# Altium project Brightness_measure.PrjPcb
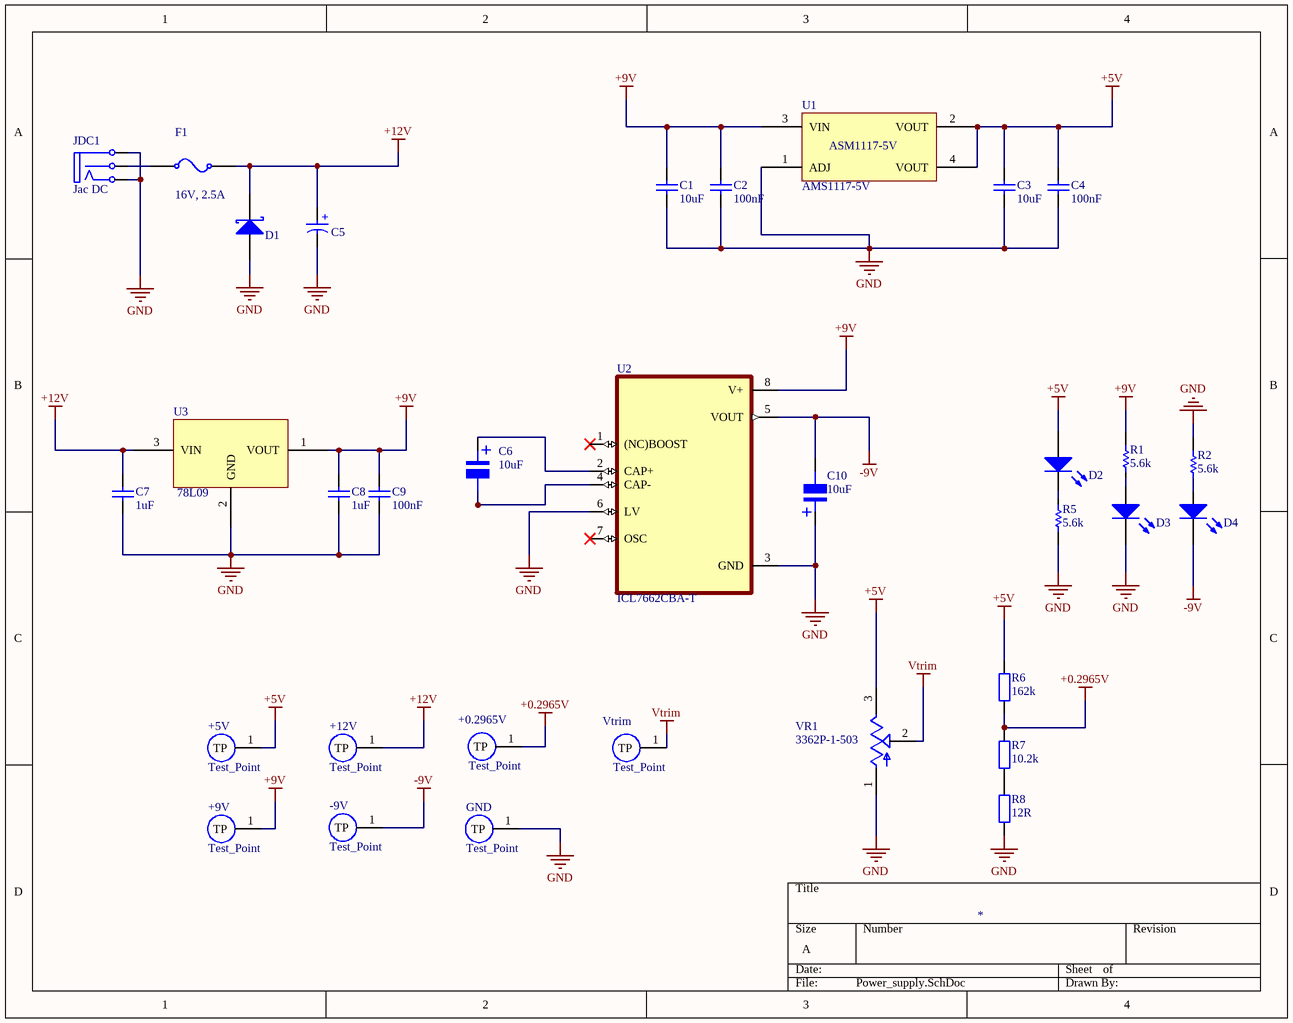
[diagram p0: Power_supply.SchDoc]
2 sheets, 56 parts. Net scope: flat (ports and power ports of the same name join across sheets).
Board file: PCB3.PcbDoc
Sheets:
  Power_supply.SchDoc
  Measure.SchDoc

## Sheet Power_supply.SchDoc
size A; SheetNumber: 1; SheetTotal: 2

### Parts
+0.2965V  Test_Point  [TP_2MM]
+5V  Test_Point  [TP_2MM]
+9V  Test_Point  [TP_2MM]
+12V  Test_Point  [TP_2MM]
-9V  Test_Point  [TP_2MM]
C1  10uF  [CAP_0603]
C2  100nF  [CAP_0603]
C3  10uF  [CAP_0603]
C4  100nF  [CAP_0603]
C5  22uF  [WCAP-ASLI_D4H5.5]  (value not drawn)
C6  10uF  [tu nhom 4 (b)]
C7  1uF  [CAP_0603]
C8  1uF  [CAP_0603]
C9  100nF  [CAP_0603]
C10  10uF  [tu nhom 4 (b)]
D1  D Schottky  [SS34]  (value not drawn)
D2  LED SMD  [LED_0805_Blue]  (value not drawn)
D3  LED SMD  [LED_0805_Blue]  (value not drawn)
D4  LED SMD  [LED_0805_Blue]  (value not drawn)
F1  16V, 2.5A  [Fuse_SMD_1812]
GND  Test_Point  [TP_2MM]
JDC1  Jac DC  [DC0]
R1  5.6k  [resistor_0603]
R2  5.6k  [resistor_0603]
R5  5.6k  [resistor_0603]
R6  162k  [TRO SMD 0603]
R7  10.2k  [TRO SMD 0603]
R8  12R  [TRO SMD 0603]
U1  AMS1117-5V  [AMS1117-3.3V SOT223]
U2  ICL7662CBA-T  [SOP 8]
U3  78L09  [SOT89]
VR1  3362P-1-503  [TRIM_3362P-1-503]
Vtrim  Test_Point  [TP_2MM]

### Nets
+0.2965V: +0.2965V.1(TP) R6.1 R7.2
+5V: +5V.1(TP) C3.2 C4.2 D2.1(A) R6.2 U1.2(VOUT) U1.4(VOUT) VR1.3(CW)
+9V: +9V.1(TP) C1.1 C2.2 C8.2 C9.2 R1.2 U1.3(VIN) U2.8(V+) U3.1(VOUT)
+12V: +12V.1(TP) C5.1(P) C7.2 D1.2(K) F1.1 U3.3(VIN)
-9V: -9V.1(TP) C10.2 D4.2(K) U2.5(VOUT)
GND: C1.2 C2.1 C3.1 C4.1 C5.2(N) C7.1 C8.1 C9.1 C10.1 D1.1(A) D3.2(K) GND.1(TP) JDC1.2(TN) JDC1.3(T) R2.2 R5.1 R8.1 U1.1(ADJ) U2.3(GND) U2.6(LV) U3.2(GND) VR1.1(CCW)
Vtrim: VR1.2(WIPER) Vtrim.1(TP)
NetC6_1: C6.1 U2.2(CAP+)
NetC6_2: C6.2 U2.4(CAP-)
NetD2_2: D2.2(K) R5.2
NetD3_1: D3.1(A) R1.1
NetD4_1: D4.1(A) R2.1
NetF1_0: F1.0 JDC1.1(S)
NetR7_1: R7.1 R8.2

Not connected (* = marked no-connect by the designer): U2 1((NC)BOOST)* 7(OSC)*

### Notes on the sheet
- (in symbol 865080340003) +
- (in symbol AMS1117-5V) ASM1117-5V
- (in symbol Tu Nhom 10uF 16V) +

### Library data of the parts
+0.2965V +5V +9V +12V -9V GND Vtrim = Test_Point: Test point, 2mm radius
C1 C3 = 01060310010: CAP, size 0603,10uF; Supply 2 name: Thegioiic; Capacitance Tolerance: +/-10%; ComponentLink1Description: Manufacturer; ComponentLink1URL: *; ComponentLink2Description: Datasheet; ComponentLink2URL: *; Operating Temperature: -55 to +125degC; Packaging: Tape and Reel; Supply 1 SN: *; Supply 1 name: *; Supply 1 URL: *; Supply 2 SN: *; Supply 2 URL: https://www.thegioiic.com/tu-gom-0603-10uf-16v; Dissipation Factor: *; Height: *; Mounting Technology: SMT; Size: 0603; Capacitance: 10uF; Technical Reference: *
C2 C4 C9 = 01060310410: CAP, size 0603, 100nF; Supply 1 SN: 885012206095; Supply 1 name: Wurth Elektronik; Supply 2 name: Thegioiic; Capacitance Tolerance: +/-10%; ComponentLink1Description: Manufacturer; ComponentLink1URL: http://www.we-online.de; ComponentLink2Description: Datasheet; ComponentLink2URL: https://www.we-online.com/catalog/datasheet/885012206095.pdf; Operating Temperature: -55 to +125degC; Packaging: Tape and Reel; Supply 1 URL: https://www.we-online.com/en/components/products/WCAP-CSGP-50VDC?sq=885012206095R#885012206095R; Supply 2 SN: *; Supply 2 URL: https://www.thegioiic.com/tu-gom-0603-100nf-0-1uf-50v; Dissipation Factor: *; Height: *; Mounting Technology: SMT; Size: 0603; Capacitance: 100nF; Technical Reference: *
C5 = 865080340003: V-Chip, D4 x H5.5mm, 22uF, 16V; Capacitance Tolerance: +/-20%; Dissipation Factor: 16%; Endurance: 2000h; Leakage Current: 3.52uA; Ripple Current: 90mA; Supply 1 Name: Mouser; Supply 1 SN: 710-865080340003; Supply 2 Name: thegioiic; Category: Aluminum Electrolytic Capacitors; ComponentLink2Description: Datasheet Link; ComponentLink2URL: https://www.we-online.com/redexpert/spec/865080340003?ad; Mount: Surface Mount; Operating Temperature Max: 105°C; Operating Temperature Min: -55°C; Packaging: Tape and Reel; Height: 5.5mm; Diameter: 4mm; Capacitance: 22uF; Rated Voltage (DC): 16V; Supply 1 URL: https://www.mouser.com/ProductDetail/Wurth-Elektronik/865080340003?qs=0KOYDY2FL2%252BowmC4S50IuQ%3D%3D; Supply 2 URL: https://www.thegioiic.com/tu-nhom-smd-22uf-16v-4x5-4mm
C6 C10 = Tu Nhom 10uF 16V: Dán; Don_Vi: Con; So_Chan: 2; Ten_Linh_Kien: Tụ Nhôm 10uF 16V 4x5MM; Ma_Hang: MH001458; Chung_Loai: Dán; Kieu_Chan: *
C7 C8 = 01060310510: CAP, size 0603, 1uF; Supply 1 SN: 885012206126; Supply 1 name: Wurth Elektronik; Supply 2 name: Thegioiic; Capacitance Tolerance: +/-10%; ComponentLink1Description: Manufacturer; ComponentLink1URL: http://www.we-online.de; ComponentLink2Description: Datasheet; ComponentLink2URL: https://www.we-online.com/components/products/datasheet/885012206126.pdf; Operating Temperature: -55 to +125degC; Packaging: Tape and Reel; Supply 1 URL: https://www.we-online.com/en/components/products/WCAP-CSGP-50VDC?sq=885012206126#885012206126; Supply 2 SN: *; Supply 2 URL: https://www.thegioiic.com/tu-gom-0603-1uf-50v; Dissipation Factor: *; Height: *; Mounting Technology: SMT; Size: 0603; Capacitance: 1uF; Technical Reference: *
D1 = D Schottky: Schottky Diode; Published: 8-Jun-2000; LatestRevisionDate: 17-Jul-2002; LatestRevisionNote: Re-released for DXP Platform.; PackageReference: SMB; Publisher: Altium Limited; PackageDescription: DO-214-AA/SMB; 2 C-Bend Leads; Body 5.3 x 3.6 mm, inc. leads (LxW); Code_JEDEC: DO-214-AA
D2-D4 = LED SMD: LED
F1 = 061812200008: Resettable Fuse, Size 1812, 8V, 2A; Manufacturer: Littelfuse; Threshold Current: 100A; Trip Current: 4A; Supply 1 Name: Mouser; Supply 1 SN: 650-MINISMDC200F-2; Supply 2 Name: Digikey; Supply 2 SN: MINISMDC200F-2TR-ND; Supply 3 Name: Thegioiic; Threshold Voltage: 8V; Hold Current: 2A; Size: 1812; Mounting Technology: SMT/SMD; ComponentLink1Description: Datasheet link; ComponentLink1URL: https://www.littelfuse.com/~/media/electronics/product_specifications/resettable_ptcs/littelfuse_ptc_minismdc300f_2_product_specification.pdf.pdf; ComponentLink2Description: Supply 1 URL; ComponentLink2URL: https://www.mouser.vn/ProductDetail/Littelfuse/MINISMDC200F-2?qs=F6FIpiMdEVbPu4q%2F42CC1w%3D%3D; ComponentLink3Description: Supply 2 URL; ComponentLink3URL: https://www.digikey.com/en/products/detail/littelfuse-inc/MINISMDC200F-2/1045898?s=N4IgTCBcDaIAQFkCSA5JBlBARAwmADPgGIC0EAugL5A; ComponentLink4Description: Supply 3 URL; ComponentLink4URL: https://www.thegioiic.com/cau-chi-tu-phuc-hoi-1812-8v-2a; Supply 3 SN: N/A
JDC1 = DCIN: Jac DC input; Value: Jac DC
R1 R2 R5 = 0006035621: RES, 5.6k Ohm, size 0603, 1%; Resistance Tolerant: +/-1%; Rated Power: 1/4W; Supply 1 Name: Mouser; Supply 1 SN: 667-ERJ-UP3F5601V; Supply 2 Name: Digikey; Supply 2 SN: 10-ERJ-UP3F5601VTR-ND 10-ERJ-UP3F5601VCT-ND 10-ERJ-UP3F5601VDKR-ND; Resistance: 5.6k; Size: 0603; Mounting Technology: SMT; ComponentLink1Description: Datasheet link; ComponentLink1URL: https://api.pim.na.industrial.panasonic.com/file_stream/main/fileversion/4484; ComponentLink2Description: Supply 1 URL; ComponentLink2URL: https://www.mouser.vn/ProductDetail/Panasonic/ERJ-UP3F5601V?qs=sGAEpiMZZMvdGkrng054twq3eZrCFN89ezYxgAsnxBTZYD17cS%252B65A%3D%3D; ComponentLink3Description: Supply 2 URL; ComponentLink3URL: https://www.digikey.com/en/products/detail/panasonic-electronic-components/ERJ-UP3F5601V/12092890
R6 = Tro 0603 1% 162k: Dán
R7 = tro 0603 1% 10.2k: Dán
R8 = tro 0805 1% 12R: Dán
U1 = AMS1117-5V: AMS1117-5V, OUT 5V 1A.
U2 = ICL7662CBA-T: MF: {'manufacturer': u'Analog Devices Inc./Maxim Integrated'}; MP: ICL7662CBA+T; Package: None; Price: None; Value: *; Availability: Unavailable
U3 = 78L09: 78L09, OUT 9V, 0.1A
VR1 = 3362P-1-503: 50 kOhms 0.5W, 1/2W PC Pins Through Hole Trimmer Potentiometer Cermet 1 Turn Top Finger Adjustment; MF: Bourns; Purchase-URL: https://pricing.snapeda.com/search/part/3362P-1-503/?ref=eda; Check_prices: https://www.snapeda.com/parts/3362P-1-503/Bourns/view-part/1483011/?ref=eda; SnapEDA_Link: https://www.snapeda.com/parts/3362P-1-503/Bourns/view-part/1483011/?ref=snap; Package: 3116 Bourns; MP: 3362P-1-503; Value: *; Availability: Warning; Price: None

## Sheet Measure.SchDoc
size A; SheetNumber: 2; SheetTotal: 2
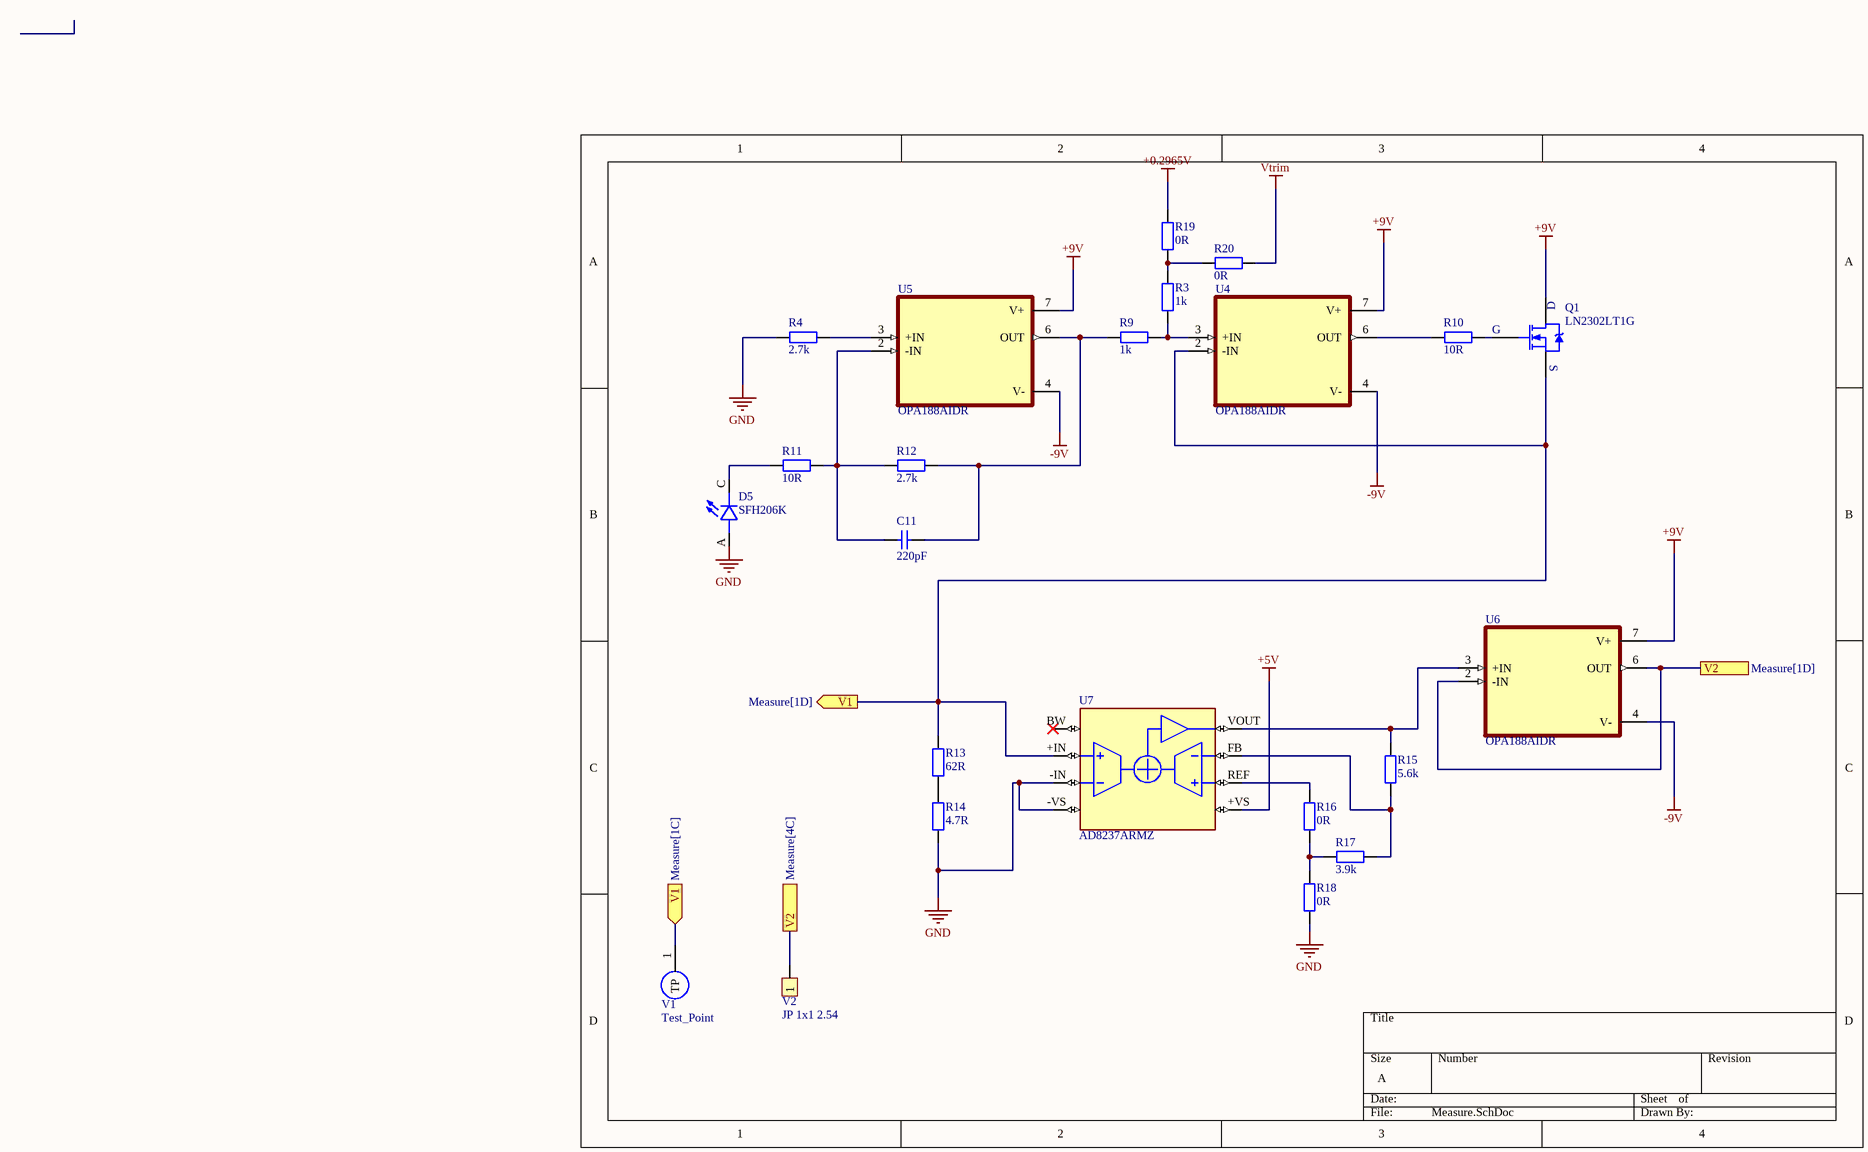
[diagram p1: Measure.SchDoc]

### Parts
C11  220pF  [Tu 0603]
D5  SFH206K  [SFH206K]
Q1  LN2302LT1G  [SOT95P240X120-3N]
R3  1k  [tro smd 0603]
R4  2.7k  [TRO SMD 0603]
R9  1k  [tro smd 0603]
R10  10R  [Tro smd 0603]
R11  10R  [Tro smd 0603]
R12  2.7k  [TRO SMD 0603]
R13  62R  [TRO SMD 0603]
R14  4.7R  [TRO SMD 0603]
R15  5.6k  [TRO SMD 0603]
R16  0R  [tro smd 0603]
R17  3.9k  [TRO SMD 0603]
R18  0R  [tro smd 0603]
R19  0R  [tro smd 0603]
R20  0R  [tro smd 0603]
U4  OPA188AIDR  [SOIC127P599X175-8N]
U5  OPA188AIDR  [SOIC127P599X175-8N]
U6  OPA188AIDR  [SOIC127P599X175-8N]
U7  AD8237ARMZ  [AD8237ARMZ]
V1  Test_Point  [TP_2MM]
V2  JP 1x1 2.54  [JP 1x1 DT]

### Ports
V1 (in, see Measure[1C]), V1 (out, see Measure[1D]), V2 (see Measure[1D]), V2 (see Measure[4C])

### Nets
+0.2965V: R19.2
+5V: U7.+VS
+9V: Q1.3(D) U4.7(V+) U5.7(V+) U6.7(V+)
-9V: U4.4(V-) U5.4(V-) U6.4(V-)
GND: D5.A R4.1 R14.1 R18.2 U7.-IN U7.-VS
Vtrim: R20.2
NetC11_1: C11.1 R9.1 R12.2 U5.6(OUT)
NetC11_2: C11.2 R11.2 R12.1 U5.2(-IN)
NetD5_C: D5.C R11.1
NetQ1_1: Q1.1(G) R10.2
NetQ1_2: Q1.2(S) R13.2 U4.2(-IN) U7.+IN V1.1(TP) ; port V1
NetR3_1: R3.1 R9.2 U4.3(+IN)
NetR3_2: R3.2 R19.1 R20.1
NetR4_2: R4.2 U5.3(+IN)
NetR10_1: R10.1 U4.6(OUT)
NetR13_1: R13.1 R14.2
NetR15_1: R15.1 R17.2 U7.FB
NetR15_2: R15.2 U6.3(+IN) U7.VOUT
NetR16_1: R16.1 U7.REF
NetR16_2: R16.2 R17.1 R18.1
NetU6_2: U6.2(-IN) U6.6(OUT) V2.1 ; port V2

Not connected (* = marked no-connect by the designer): U7 BW*

### Library data of the parts
C11 = Tu 0603 220pF 50V 10%: Dán
D5 = SFH206K: photodiode, 850nm; MP: L08R5000Q1; MF: LED Technology; Value: *; SnapEDA_Link: https://www.snapeda.com/parts/L08R5000Q1/LED+Technology/view-part/?ref=snap; Check_prices: https://www.snapeda.com/parts/L08R5000Q1/LED+Technology/view-part/?ref=eda; Availability: In Stock; Price: None; Package: None
Q1 = MOSFET: SOT-23-3, MOSFET kênh N, 20V, 2.3A
R3 R9 = Tro 0603 1% 1k: Dán; So_Chan: 2; Don_Vi: Con; Ten_Linh_Kien: Trở 0603 1% 1k; Ma_Hang: MH006334; Chung_Loai: Dán; Kieu_Chan: *
R4 R12 = tro 0603 5% 2.7k: dán
R10 R11 = Tro 0603 5% 10R: Dán; So_Chan: 2; Ten_Linh_Kien: Trở 0603 5% 10R; Ma_Hang: MH006317; Don_Vi: Con; Chung_Loai: Dán; Kieu_Chan: *
R13 = Tro 0603 1% 62R: Dán
R14 = Tro 0603 1% 4.7R: Dán
R15 = Tro 0603 1% 5.6k: Dán
R16 R18-R20 = Tro 0603 1% 0R: Dán; Don_Vi: Con; So_Chan: 2; Ten_Linh_Kien: Trở 0603 1% 0R; Ma_Hang: MH005792; Chung_Loai: Dán; Kieu_Chan: *
R17 = Tro 0805 1% 3.9k: Dán
U4-U6 = OPA188AIDR: Precision, Low-Noise, Rail-to-Rail Output, 36V Zero-Drift Operational Amplifier 8-SOIC -40 to 125; MF: Texas Instruments; Package: SOIC-8 Texas Instruments; Texas_Instruments-Purchase-URL: https://snapeda.com/shop?store=Texas+Instruments&id=1236132; SnapEDA_Link: https://www.snapeda.com/parts/OPA188AIDR/Texas%20Instruments/view-part/1236132/?ref=snap; Mouser-Purchase-URL: https://snapeda.com/shop?store=Mouser&id=1236132; DigiKey-Purchase-URL: https://snapeda.com/shop?store=DigiKey&id=1236132; MP: OPA188AIDR; Digi-Key_Part_Number: 296-41346-1-ND; Value: *
U7 = AD8237ARMZ: Micropower, Zero Drift, True Rail-to-Rail Instrumentation Amplifier; MF: Analog Devices; Package: MSOP-8 Analog Devices; Price: None; Check_prices: https://www.snapeda.com/parts/AD8237ARMZ/Analog+Devices/view-part/?ref=eda; Value: *; SnapEDA_Link: https://www.snapeda.com/parts/AD8237ARMZ/Analog+Devices/view-part/?ref=snap; MP: AD8237ARMZ; Availability: In Stock; Purchase-URL: https://pricing.snapeda.com/search?q=AD8237ARMZ&ref=eda
V1 = Test_Point: Test point, 2mm radius
V2 = JP 1x1 2.54 Duc Cong: Cắm; Ten_Linh_Kien: Jump Đơn Đực 2.54MM 1x40P Cong Đứng; Don_Vi: Con; Ma_Hang: MH000904; Ghi_Chu: *; Kieu_Chan: *; Chung_Loai: Cắm

## Nets that join several sheets
+0.2965V: Power_supply (+0.2965V.1 R6.1 R7.2), Measure (R19.2)
+5V: Power_supply (8 pins), Measure (U7.+VS)
+9V: Power_supply (9 pins), Measure (Q1.3 U4.7 U5.7 U6.7)
-9V: Power_supply (-9V.1 C10.2 D4.2 U2.5), Measure (U4.4 U5.4 U6.4)
GND: Power_supply (22 pins), Measure (6 pins)
Vtrim: Power_supply (VR1.2 Vtrim.1), Measure (R20.2)